# EAGLE schematic Flight control unit Schematic (EAGLE 9.5.1)
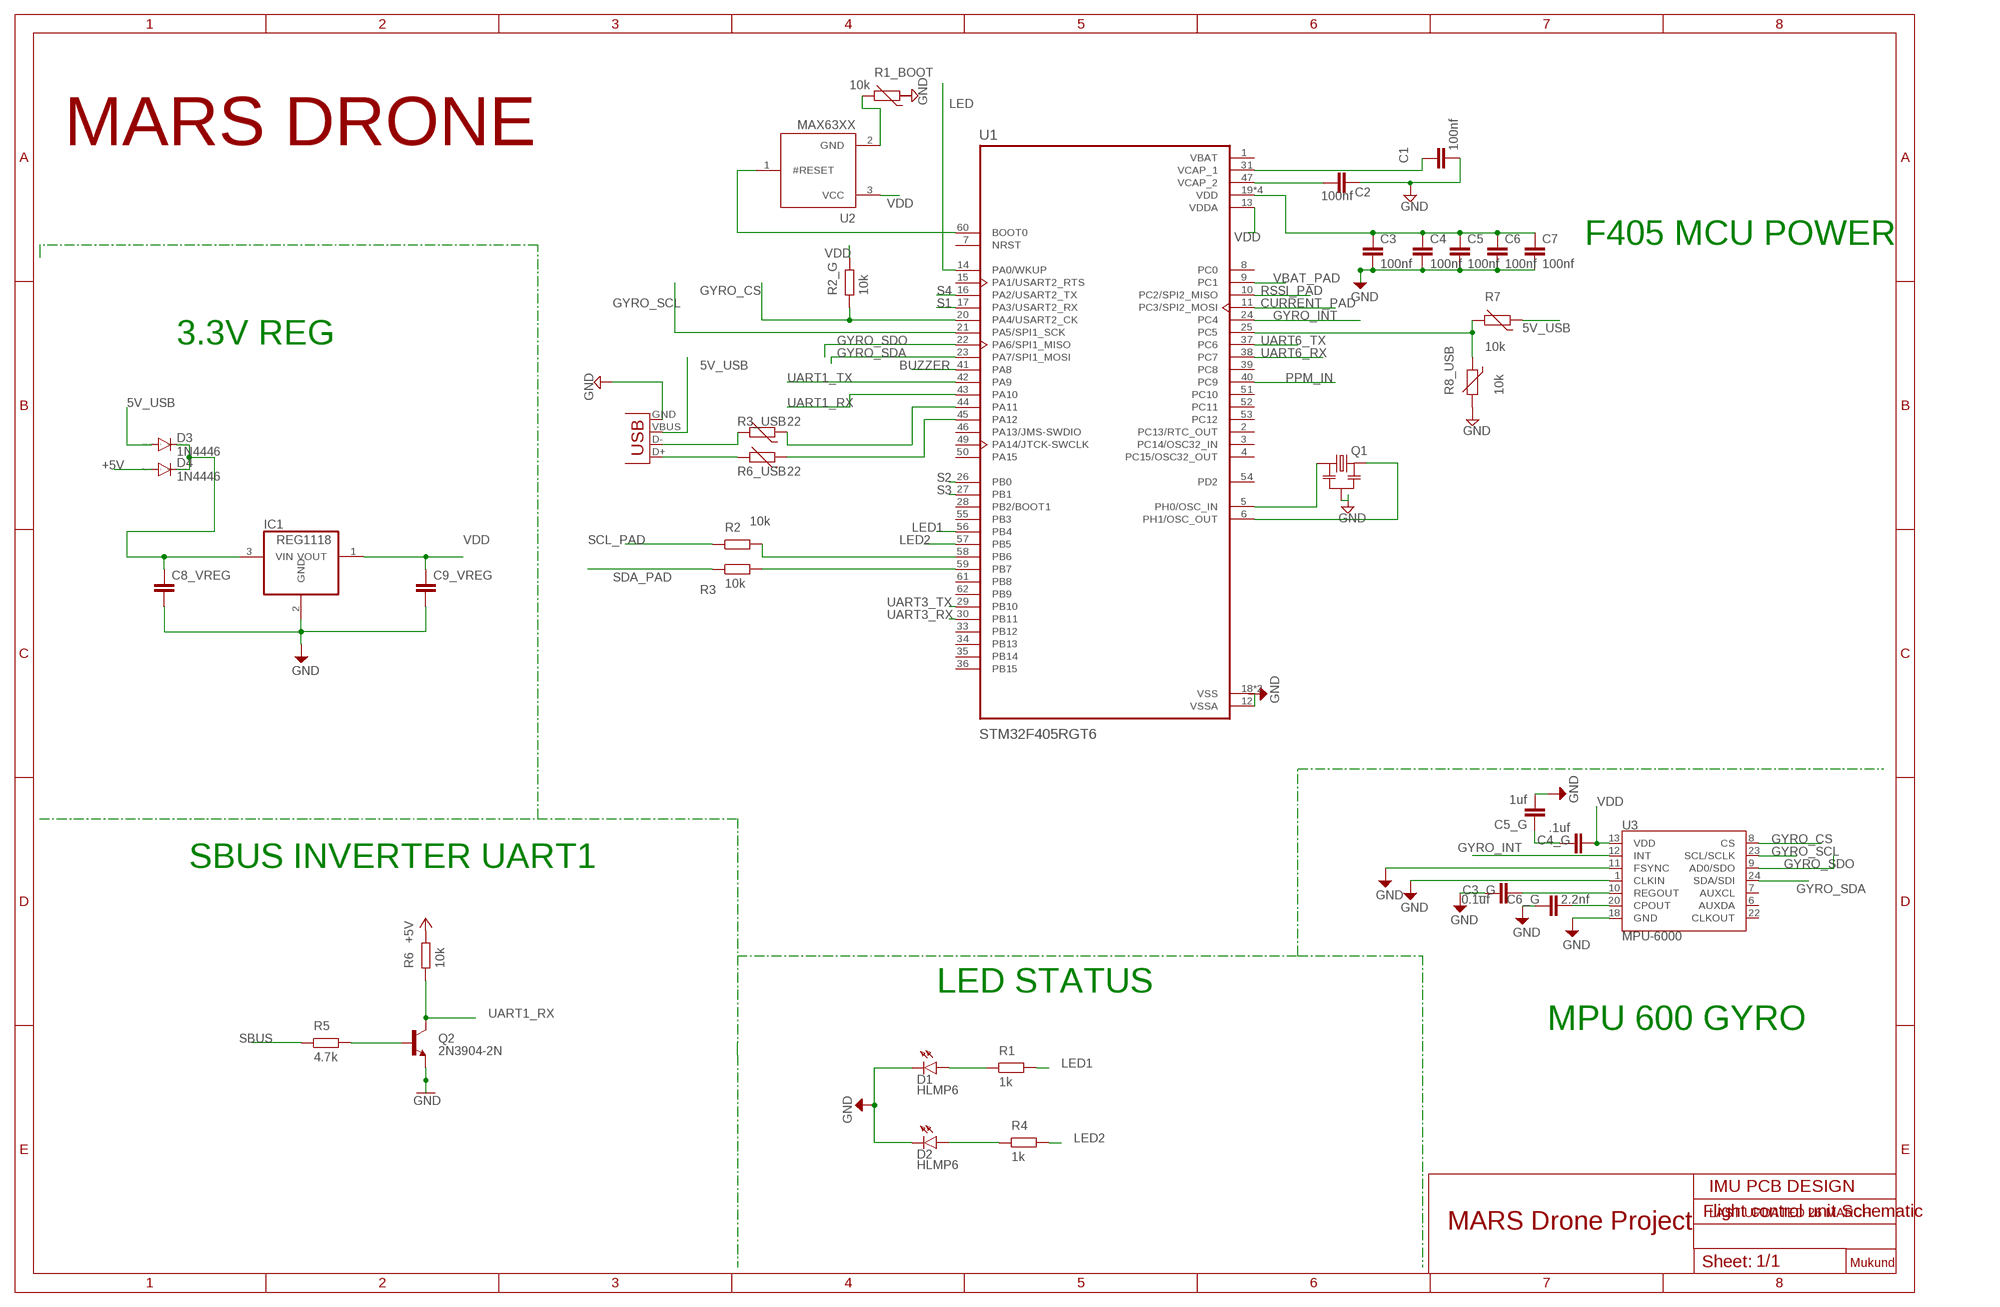
[diagram p0: schematic, sheet 1]

## Parts
C1  100nf  C2,5-3  [C2.5-3]
C2  100nf  C2,5-3  [C2.5-3]
C3  100nf  C2.5/2  [C2.5-2]
C3_G  0.1uf  C2,5-3  [C2.5-3]
C4  100nf  C2.5/2  [C2.5-2]
C4_G  .1uf  C2,5-3  [C2.5-3]
C5  100nf  C2.5/2  [C2.5-2]
C5_G  1uf  C2,5-3  [C2.5-3]
C6  100nf  C2.5/2  [C2.5-2]
C6_G  2.2nf  C2,5-3  [C2.5-3]
C7  100nf  C2.5/2  [C2.5-2]
C8_VREG  C2,5-3  [C2.5-3]
C9_VREG  C2,5-3  [C2.5-3]
D1  HLMP6  [HLMP6]
D2  HLMP6  [HLMP6]
D3  1N4446  [DO35-10]
D4  1N4446  [DO35-10]
IC1  REG1118  [SOT223]
Q1  RESONATOR-MURATACST_CE  [RESONATOR_MURATA2]
Q2  2N3904-2N  [TO92]
R1  1k  R  (no package)
R1_BOOT  10k  THERMISTOR_R-2,5  [RS-2,5]
R2  10k  R  (no package)
R2_G  10k  R  (no package)
R3  10k  R  (no package)
R3_USB  22  THERMISTOR_R-2,5  [RS-2,5]
R4  1k  R  (no package)
R5  4.7k  R  (no package)
R6  10k  R  (no package)
R6_USB  22  THERMISTOR_R-2,5  [RS-2,5]
R7  10k  THERMISTOR_R-2,5  [RS-2,5]
R8_USB  10k  THERMISTOR_R-2,5  [RS-2,5]
U1  STM32F405RGT6  [QFP50P1200X1200X160-64N]
U2  MAX63XX  [SOT23]
U3  MPU-6000  [QFN-24-EP]
X1  USB-A-S  [USB-A-S]

## Nets
5V_USB: D3.A R7.1 X1.VBUS
+5V: D4.A R6.2
BUZZER: U1.41(PA8)
CURRENT_PAD: U1.11(PC3/SPI2_MOSI)
GND: C1.2 C2.2 C3.2 C3_G.1 C4.2 C5.2 C5_G.2 C6.2 C6_G.1 C7.2 C8_VREG.2 C9_VREG.2 D1.K D2.K IC1.2(GND) Q1.2 Q2.3(E) R8_USB.2 U3.1(CLKIN) U3.11(FSYNC) U3.18(GND) X1.GND
GYRO_CS: R2_G.1 U1.20(PA4/USART2_CK) U3.8(CS)
GYRO_INT: U1.24(PC4) U3.12(INT)
GYRO_SCL: U1.21(PA5/SPI1_SCK) U3.23(SCL/SCLK)
GYRO_SDA: U1.23(PA7/SPI1_MOSI) U3.24(SDA/SDI)
GYRO_SDO: U1.22(PA6/SPI1_MISO) U3.9(AD0/SDO)
LED: U1.14(PA0/WKUP)
LED1: R1.2 U1.56(PB4)
LED2: R4.2 U1.57(PB5)
N$1: C6_G.2 U3.20(CPOUT)
N$2: D1.A R1.1
N$3: D2.A R4.1
N$4: U1.12(VSSA) U1.18(VSS) U1.63(VSS)
N$5: C4_G.1 C5_G.1
N$6: C3.1 C4.1 C5.1 C6.1 C7.1 U1.19(VDD) U1.32(VDD) U1.48(VDD) U1.64(VDD)
N$8: C3_G.2 U3.10(REGOUT)
N$9: R3_USB.1 U1.44(PA11)
N$10: R6_USB.1 U1.45(PA12)
N$11: Q2.2(B) R5.2
N$12: C8_VREG.1 D3.C D4.C IC1.3(VIN)
N$15: R7.2 R8_USB.1 U1.25(PC5)
N$19: C1.1 U1.31(VCAP_1)
N$20: C2.1 U1.47(VCAP_2)
N$21: R2.2 U1.58(PB6)
N$22: R3.2 U1.59(PB7)
N$23: U1.60(BOOT0) U2.1(#RESET)
N$24: R1_BOOT.2 U2.2(GND)
N$25: R6_USB.2 X1.D+
N$26: R3_USB.2 X1.D-
N$30: Q1.1 U1.5(PH0/OSC_IN)
N$31: Q1.3 U1.6(PH1/OSC_OUT)
PPM_IN: U1.40(PC9)
RSSI_PAD: U1.10(PC2/SPI2_MISO)
S1: U1.17(PA3/USART2_RX)
S2: U1.26(PB0)
S3: U1.27(PB1)
S4: U1.16(PA2/USART2_TX)
SBUS: R5.1
SCL_PAD: R2.1
SDA_PAD: R3.1
UART1_RX: Q2.1(C) R6.1 U1.43(PA10)
UART1_TX: U1.42(PA9)
UART3_RX: U1.30(PB11)
UART3_TX: U1.29(PB10)
UART6_RX: U1.38(PC7)
UART6_TX: U1.37(PC6)
VBAT_PAD: U1.9(PC1)
VDD: C4_G.2 C9_VREG.1 IC1.1(VOUT) R2_G.2 U1.13(VDDA) U2.3(VCC) U3.13(VDD)
Unconnected: R1_BOOT.1 U1.2(PC13/RTC_OUT) U1.3(PC14/OSC32_IN) U1.4(PC15/OSC32_OUT) U1.7(NRST) U1.8(PC0) U1.15(PA1/USART2_RTS) U1.28(PB2/BOOT1) U1.33(PB12) U1.34(PB13) U1.35(PB14) U1.36(PB15) U1.39(PC8) U1.46(PA13/JMS-SWDIO) U1.49(PA14/JTCK-SWCLK) U1.50(PA15) U1.51(PC10) U1.52(PC11) U1.53(PC12) U1.54(PD2) U1.55(PB3) U1.61(PB8) U1.62(PB9) U3.6(AUXDA) U3.7(AUXCL) U3.22(CLKOUT)

## Notes on the sheet
- MARS DRONE
- F405 MCU POWER
- 3.3V REG
- SBUS INVERTER UART1
- LED STATUS
- MPU 600 GYRO
- IMU PCB DESIGN
- LAST UPDATED 26 MARCH
- MARS Drone Project
- Mukund

## Power pins joined to a net without a drawn wire
VBAT: U1.1(VBAT)

## Library data of the parts
C1-C3 C3_G C4 C4_G C5 C5_G C6 C6_G C7 C8_VREG C9_VREG = capacitor-wima:C: CAPACITOR naming: grid - package width
D1 D2 = display-hp:HLMP6: LED 2mm horizontal; MF: AGILENT TECHNOLOGIES; MPN: HLMP-6500; OC_FARNELL: 1652490; OC_NEWARK: 40K0088
D3 D4 = diode:1N4446: DIODE high speed (Philips)
IC1 = burr-brown:REG1118: 800mA Low Dropout (LDO) Positive Regulator with Current Source and Sink Capability; MPN: REG1118-2.85/2K5G4; OC_FARNELL: unknown; OC_NEWARK: 14M2185
Q1 = m-pad-2.1:RESONATOR-MURATA: Murata ceramic Resonator "ceralock" CSTCE series with built in load capacitance +- 0.5% tolerance 12.51MHz to 19.99MHz 16MHz murata part#: CSTCE16M0V53-R0 16MHz digikey part#: 490-1198-1-ND $1.33 each
Q2 = m-pad-2.1:2N3904: NPN TRANSISTOR
R1 R2 R2_G R3-R6 = ngspice-simulation:R: RESISTOR
R1_BOOT R3_USB R6_USB R7 R8_USB = discrete:THERMISTOR_: Thermo Resistor
U1 = STM32F405RGT6:STM32F405RGT6: High-performance foundation line, ARM Cortex-M4 core with DSP and FPU, 1 Mbyte Flash, 168 MHz CPU, ART Accelerator Check prices <https://pricing.snapeda.com/parts/STM32F405RGT6/STMicroelectronics/view-part?ref=eda>; AVAILABILITY: Warning; DESCRIPTION: ARM® Cortex®-M4 STM32F4 Microcontroller IC 32-Bit 168MHz 1MB (1M x 8) FLASH 64-LQFP (10x10); MF: STMicroelectronics; MP: STM32F405RGT6; PACKAGE: LQFP-64 STMicroelectronics; PRICE: None; PURCHASE-URL: https://pricing.snapeda.com/search/part/STM32F405RGT6/?ref=eda
U2 = m-pad-2.1:MAX63XX: Maxim's MAX63xx 3-Pin, Ultra-Low-Power SC70/SOT µP Reset Circuits General Description: The MAX6326/MAX6327/MAX6328/MAX6346/MAX6347/ MAX6348 microprocessor (µP) supervisory circuits monitor the power supplies in µP and digital systems. These devices provide excellent circuit reliability and low cost by eliminating external components and adjustments when used with 2.5V, 3V, 3.3V, and 5V powered circuits. These circuits perform a single function: they assert a reset signal whenever the VCC supply voltage declines below a preset threshold, keeping it asserted for at least 100ms after VCC has risen above the reset threshold. The only difference between the devices is their output. The MAX6326/MAX6346 (push-pull) and MAX6328/ MAX6348 (open-drain) have an active-low reset output. The MAX6327/MAX6347 have an active-high push-pull reset output. All of these parts are guaranteed to be in the correct state for VCC down to 1V. The reset comparator is designed to ignore fast transients on VCC. Reset thresholds are factory-trimmable between 2.2V and 4.63V, in approximately 100mV increments. Twenty-one standard versions are available. Contact the factory for availability of nonstandard versions. Ultra-low supply currents (1µA max for the MAX6326/ MAX6327/MAX6328) make these parts ideal for use in portable equipment. All six devices are available in space-saving SOT23 and SC70 packages. Features: Ultra-Low 1µA (max) Supply Current (MAX6326/MAX6327/MAX6328) Precision Monitoring of 2.5V, 3V, 3.3V, and 5V Power-Supply Voltages Reset Thresholds Available from 2.2V to 4.63V Fully Specified Over Temperature 100ms (min) Power-On Reset Pulse Width Low Cost Available in Three Versions: Push-Pull RESET, Push-Pull RESET, and Open-Drain RESET Power-Supply Transient Immunity No External Components 3-Pin SC70/SOT23 Packages Pin Compatible with MAX803/MAX809/MAX810 Please send any comments to: messi@users.sourceforge.net
U3 = MPU-6000:MPU-6000: Invensense MPU-6000 6-Axis Gryoscope/Accelerometer 3-axis gyroscope, 3-axis accelerometer in a 4x4 package. The MPU-6000 is the world’s first 6-axis I²C MotionTracking device designed for the low power, low cost, and high performance requirements of smartphones, tablets and wearable sensors. Datasheet <http://cdn.sparkfun.com/datasheets/Components/General%20IC/PS-MPU-6000A.pdf> SparkFun Products MPU-6000 - Motion Processing Unit <https://www.sparkfun.com/products/11234> (SEN-11234) SparkFun UDB5 - PIC UAV Development Board <https://www.sparkfun.com/products/11703> (GPS-11703) Check prices <https://pricing.snapeda.com/parts/MPU-6000/TDK%20InvenSense/view-part?ref=eda>; AVAILABILITY: Warning; DESCRIPTION: Accelerometer, Gyroscope, 6 Axis Sensor I²C, SPI Output; MF: TDK InvenSense; MP: MPU-6000; PACKAGE: QFN-24 InvenSense; PRICE: None; PURCHASE-URL: https://pricing.snapeda.com/search/part/MPU-6000/?ref=eda
X1 = con-usb:USB: USB Connectors